# Altium schematic sheet STMKernel144.SchDoc
size A3
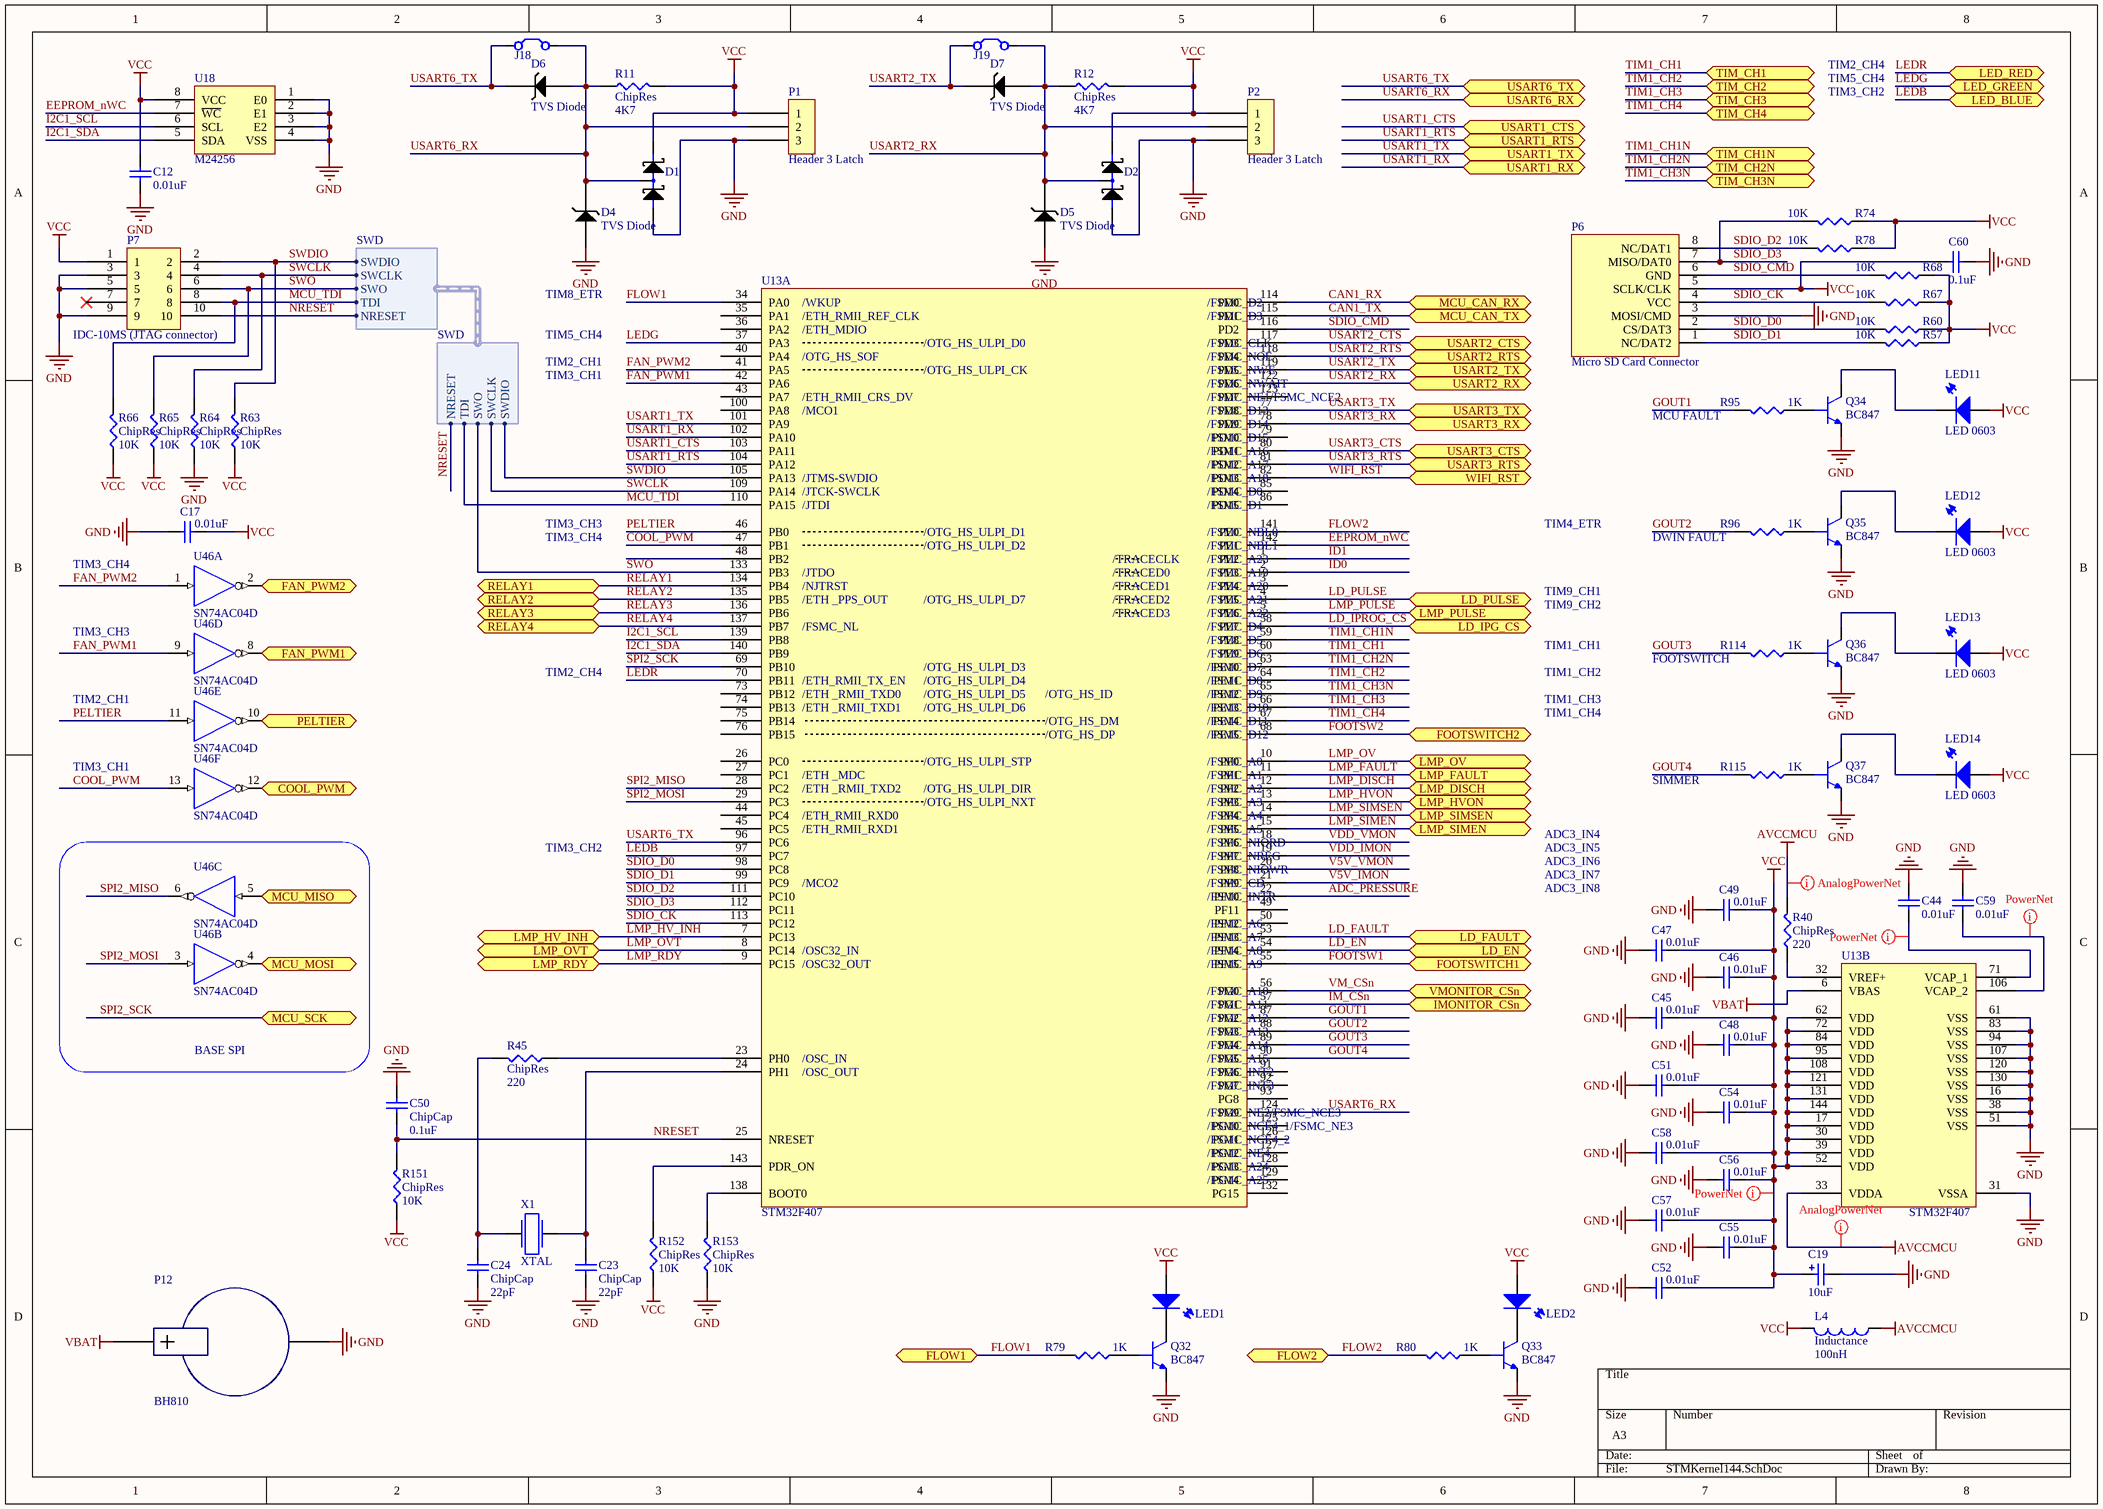
[diagram p0: STMKernel144.SchDoc]

## Parts
C12  value 0.01uF  [CAP0805]  (hidden comment: ChipCap)
C17  value 0.01uF  [CAP0805]  (hidden comment: ChipCap)
C19  value 10uF  [CAPC7343]  (hidden comment: Cap Pol SMD)
C23  ChipCap  value 22pF  [CAP0805]
C24  ChipCap  value 22pF  [CAP0805]
C44  value 0.01uF  [CAP0805]  (hidden comment: ChipCap)
C45  value 0.01uF  [CAP0805]  (hidden comment: ChipCap)
C46  value 0.01uF  [CAP0805]  (hidden comment: ChipCap)
C47  value 0.01uF  [CAP0805]  (hidden comment: ChipCap)
C48  value 0.01uF  [CAP0805]  (hidden comment: ChipCap)
C49  value 0.01uF  [CAP0805]  (hidden comment: ChipCap)
C50  ChipCap  value 0.1uF  [CAP0805]
C51  value 0.01uF  [CAP0805]  (hidden comment: ChipCap)
C52  value 0.01uF  [CAP0805]  (hidden comment: ChipCap)
C54  value 0.01uF  [CAP0805]  (hidden comment: ChipCap)
C55  value 0.01uF  [CAP0805]  (hidden comment: ChipCap)
C56  value 0.01uF  [CAP0805]  (hidden comment: ChipCap)
C57  value 0.01uF  [CAP0805]  (hidden comment: ChipCap)
C58  value 0.01uF  [CAP0805]  (hidden comment: ChipCap)
C59  value 0.01uF  [CAP0805]  (hidden comment: ChipCap)
C60  value 0.1uF  [CAP0805]  (hidden comment: ChipCap)
D1  Diode Schottky  [SOT23]  (value not drawn)
D2  Diode Schottky  [SOT23]  (value not drawn)
D4  TVS Diode  [DO-214AS]
D5  TVS Diode  [DO-214AS]
D6  TVS Diode  [DO-214AS]
D7  TVS Diode  [DO-214AS]
J18  Jumper  [J0805]  (value not drawn)  (net tie, no BOM)
J19  Jumper  [J0805]  (value not drawn)  (net tie, no BOM)
L4  Inductance  value 100nH  [CM45]
LED1  LED 0603  [LED 0603]  (value not drawn)
LED2  LED 0603  [LED 0603]  (value not drawn)
LED11  LED 0603  [PLCC-2]
LED12  LED 0603  [PLCC-2]
LED13  LED 0603  [PLCC-2]
LED14  LED 0603  [PLCC-2]
P1  Header 3 Latch  [Header 3 latch]
P2  Header 3 Latch  [Header 3 latch]
P6  Micro SD Card Connector  [WR-CRD SD Micro]
P7  IDC-10MS (JTAG connector)  [IDC-10MS(MR)]
P12  BH810  [BH810]
Q32  BC847  [SOT23]
Q33  BC847  [SOT23]
Q34  BC847  [SOT23]
Q35  BC847  [SOT23]
Q36  BC847  [SOT23]
Q37  BC847  [SOT23]
R11  ChipRes  value 4K7  [RES0805]
R12  ChipRes  value 4K7  [RES0805]
R40  ChipRes  value 220  [RES0805]
R45  ChipRes  value 220  [RES0805]
R57  value 10K  [RES0805]  (hidden comment: ChipRes)
R60  value 10K  [RES0805]  (hidden comment: ChipRes)
R63  ChipRes  value 10K  [RES0805]
R64  ChipRes  value 10K  [RES0805]
R65  ChipRes  value 10K  [RES0805]
R66  ChipRes  value 10K  [RES0805]
R67  value 10K  [RES0805]  (hidden comment: ChipRes)
R68  value 10K  [RES0805]  (hidden comment: ChipRes)
R74  value 10K  [RES0805]  (hidden comment: ChipRes)
R78  value 10K  [RES0805]  (hidden comment: ChipRes)
R79  value 1K  [RES0805]  (hidden comment: ChipRes)
R80  value 1K  [RES0805]  (hidden comment: ChipRes)
R95  value 1K  [RES0805]  (hidden comment: ChipRes)
R96  value 1K  [RES0805]  (hidden comment: ChipRes)
R114  value 1K  [RES0805]  (hidden comment: ChipRes)
R115  value 1K  [RES0805]  (hidden comment: ChipRes)
R151  ChipRes  value 10K  [RES0805]
R152  ChipRes  value 10K  [RES0805]
R153  ChipRes  value 10K  [RES0805]
U13  STM32F407  [LQFP144]  (parts A,B of 2)
U18  M24256  [SOIC8]
U46  SN74AC04D  [D014_N]  (parts A,B,C,D,E,F of 6)
X1  XTAL  [BCY-W2/E4.7]

## Blocks framed on the sheet
BASE SPI: U46

## Ports
COOL_PWM, FAN_PWM1, FAN_PWM2, FLOW1, FLOW2, FOOTSWITCH1, FOOTSWITCH2, IMONITOR_CSn, LD_EN, LD_FAULT, LD_IPG_CS, LD_PULSE, LED_BLUE, LED_GREEN, LED_RED, LMP_DISCH, LMP_FAULT, LMP_HV_INH, LMP_HVON, LMP_OV, LMP_OVT, LMP_PULSE, LMP_RDY, LMP_SIMEN, LMP_SIMSEN, MCU_CAN_RX, MCU_CAN_TX, MCU_MISO, MCU_MOSI, MCU_SCK, PELTIER, RELAY1, RELAY2, RELAY3, RELAY4, TIM_CH1, TIM_CH1N, TIM_CH2, TIM_CH2N, TIM_CH3, TIM_CH3N, TIM_CH4, USART1_CTS, USART1_RTS, USART1_RX, USART1_TX, USART2_CTS, USART2_RTS, USART2_RX, USART2_TX, USART3_CTS, USART3_RTS, USART3_RX, USART3_TX, USART6_RX, USART6_TX, VMONITOR_CSn, WIFI_RST

## Harnesses
SWD: SWDIO, SWCLK, SWO, TDI, NRESET

## Nets
AVCCMCU: L4.2 R40.2 U13.33(VDDA)
GND: C12.1 C17.1 C19.2 C23.1 C24.1 C44.1 C45.2 C46.2 C47.2 C48.2 C49.2 C50.2 C51.2 C52.1 C54.2 C55.2 C56.2 C57.2 C58.2 C59.1 C60.2 D1.1 D2.1 D4.2 D5.2 P1.3 P2.3 P6.3(MOSI/CMD) P7.3 P7.5 P7.9 P12.1(BN) Q32.2 Q33.2 Q34.2 Q35.2 Q36.2 Q37.2 R64.1 R153.1 U13.16(VSS) U13.31(VSSA) U13.38(VSS) U13.51(VSS) U13.61(VSS) U13.83(VSS) U13.94(VSS) U13.107(VSS) U13.120(VSS) U13.130(VSS) U18.1(E0) U18.2(E1) U18.3(E2) U18.4(VSS) U46.7(GND)
VBAT: P12.2(BP) U13.6(VBAS)
VCC: C12.2 C17.2 C19.1 C45.1 C46.1 C47.1 C48.1 C49.1 C51.1 C52.2 C54.1 C55.1 C56.1 C57.1 C58.1 C60.1 D1.2 D2.2 L4.1 LED1.2 LED2.2 LED11.2 LED12.2 LED13.2 LED14.2 P1.1 P2.1 P6.5(SCLK/CLK) P7.1 R11.2 R12.2 R57.2 R60.2 R63.1 R65.1 R66.1 R67.2 R68.2 R74.2 R78.2 R151.1 R152.1 U13.17(VDD) U13.30(VDD) U13.39(VDD) U13.52(VDD) U13.62(VDD) U13.72(VDD) U13.84(VDD) U13.95(VDD) U13.108(VDD) U13.121(VDD) U13.131(VDD) U13.144(VDD) U18.8(VCC) U46.14(VCC)
ADC_PRESSURE: U13.22(PF10)
CAN1_RX: U13.114(PD0) ; port MCU_CAN_RX
CAN1_TX: U13.115(PD1) ; port MCU_CAN_TX
COOL_PWM: U13.47(PB1) U46.13(A)
COOL_PWM: U46.12(Y) ; port COOL_PWM  [a separate net that carries the same name]
EEPROM_nWC: U13.142(PE1) U18.7(~{WC})
FAN_PWM1: U13.42(PA6) U46.9(A)
FAN_PWM1: U46.8(Y) ; port FAN_PWM1  [a separate net that carries the same name]
FAN_PWM2: U13.41(PA5) U46.1(A)
FAN_PWM2: U46.2(Y) ; port FAN_PWM2  [a separate net that carries the same name]
FLOW1: R79.1 U13.34(PA0) ; port FLOW1
FLOW2: R80.1 U13.141(PE0) ; port FLOW2
FOOTSW1: U13.55(PF15) ; port FOOTSWITCH1
FOOTSW2: U13.68(PE15) ; port FOOTSWITCH2
GOUT1: R95.1 U13.87(PG2)
GOUT2: R96.1 U13.88(PG3)
GOUT3: R114.1 U13.89(PG4)
GOUT4: R115.1 U13.90(PG5)
I2C1_SCL: U13.139(PB8) U18.6(SCL)
I2C1_SDA: U13.140(PB9) U18.5(SDA)
ID0: U13.2(PE3)
ID1: U13.1(PE2)
IM_CSn: U13.57(PG1) ; port IMONITOR_CSn
LD_EN: U13.54(PF14) ; port LD_EN
LD_FAULT: U13.53(PF13) ; port LD_FAULT
LD_IPROG_CS: U13.58(PE7) ; port LD_IPG_CS
LD_PULSE: U13.4(PE5) ; port LD_PULSE
LEDB: U13.97(PC7) ; port LED_BLUE
LEDG: U13.37(PA3) ; port LED_GREEN
LEDR: U13.70(PB11) ; port LED_RED
LMP_DISCH: U13.12(PF2) ; port LMP_DISCH
LMP_FAULT: U13.11(PF1) ; port LMP_FAULT
LMP_HV_INH: U13.7(PC13) ; port LMP_HV_INH
LMP_HVON: U13.13(PF3) ; port LMP_HVON
LMP_OV: U13.10(PF0) ; port LMP_OV
LMP_OVT: U13.8(PC14) ; port LMP_OVT
LMP_PULSE: U13.5(PE6) ; port LMP_PULSE
LMP_RDY: U13.9(PC15) ; port LMP_RDY
LMP_SIMEN: U13.15(PF5) ; port LMP_SIMEN
LMP_SIMSEN: U13.14(PF4) ; port LMP_SIMSEN
MCU_MISO: U46.5(A) ; port MCU_MISO
MCU_MOSI: U46.4(Y) ; port MCU_MOSI
MCU_TDI: P7.8 R66.2 U13.110(PA15) ; harness SWD.TDI
NRESET: C50.1 P7.10 R151.2 U13.25(NRESET) ; harness SWD.NRESET
PELTIER: U13.46(PB0) U46.11(A)
PELTIER: U46.10(Y) ; port PELTIER  [a separate net that carries the same name]
RELAY1: U13.134(PB4) ; port RELAY1
RELAY2: U13.135(PB5) ; port RELAY2
RELAY3: U13.136(PB6) ; port RELAY3
RELAY4: U13.137(PB7) ; port RELAY4
SDIO_CK: P6.4(VCC) R67.1 U13.113(PC12)
SDIO_CMD: P6.6(GND) R68.1 U13.116(PD2)
SDIO_D0: P6.2(CS/DAT3) R60.1 U13.98(PC8)
SDIO_D1: P6.1(NC/DAT2) R57.1 U13.99(PC9)
SDIO_D2: P6.8(NC/DAT1) R78.1 U13.111(PC10)
SDIO_D3: P6.7(MISO/DAT0) R74.1 U13.112(PC11)
SPI2_MISO: U13.28(PC2) U46.6(Y)
SPI2_MOSI: U13.29(PC3) U46.3(A)
SPI2_SCK: U13.69(PB10) ; port MCU_SCK
SWCLK: P7.4 R64.2 U13.109(PA14) ; harness SWD.SWCLK
SWDIO: P7.2 R63.2 U13.105(PA13) ; harness SWD.SWDIO
SWO: P7.6 R65.2 U13.133(PB3) ; harness SWD.SWO
TIM1_CH1: U13.60(PE9) ; port TIM_CH1
TIM1_CH1N: U13.59(PE8) ; port TIM_CH1N
TIM1_CH2: U13.64(PE11) ; port TIM_CH2
TIM1_CH2N: U13.63(PE10) ; port TIM_CH2N
TIM1_CH3: U13.66(PE13) ; port TIM_CH3
TIM1_CH3N: U13.65(PE12) ; port TIM_CH3N
TIM1_CH4: U13.67(PE14) ; port TIM_CH4
USART1_CTS: U13.103(PA11) ; port USART1_CTS
USART1_RTS: U13.104(PA12) ; port USART1_RTS
USART1_RX: U13.102(PA10) ; port USART1_RX
USART1_TX: U13.101(PA9) ; port USART1_TX
USART2_CTS: U13.117(PD3) ; port USART2_CTS
USART2_RTS: U13.118(PD4) ; port USART2_RTS
USART2_RX: D2.3 D5.1 D7.2 J19.1 P2.2 R12.1 U13.122(PD6) ; port USART2_RX
USART2_TX: D7.1 J19.0 U13.119(PD5) ; port USART2_TX
USART3_CTS: U13.80(PD11) ; port USART3_CTS
USART3_RTS: U13.81(PD12) ; port USART3_RTS
USART3_RX: U13.78(PD9) ; port USART3_RX
USART3_TX: U13.77(PD8) ; port USART3_TX
USART6_RX: D1.3 D4.1 D6.2 J18.1 P1.2 R11.1 U13.124(PG9) ; port USART6_RX
USART6_TX: D6.1 J18.0 U13.96(PC6) ; port USART6_TX
V5V_IMON: U13.21(PF9)
V5V_VMON: U13.20(PF8)
VDD_IMON: U13.19(PF7)
VDD_VMON: U13.18(PF6)
VM_CSn: U13.56(PG0) ; port VMONITOR_CSn
WIFI_RST: U13.82(PD13) ; port WIFI_RST
NetC23_2: C23.2 U13.24(PH1) X1.2
NetC24_2: C24.2 R45.2 X1.1
NetC44_2: C44.2 U13.71(VCAP_1)
NetC59_2: C59.2 U13.106(VCAP_2)
NetLED1_1: LED1.1 Q32.3
NetLED2_1: LED2.1 Q33.3
NetLED11_1: LED11.1 Q34.3
NetLED12_1: LED12.1 Q35.3
NetLED13_1: LED13.1 Q36.3
NetLED14_1: LED14.1 Q37.3
NetQ32_1: Q32.1 R79.2
NetQ33_1: Q33.1 R80.2
NetQ34_1: Q34.1 R95.2
NetQ35_1: Q35.1 R96.2
NetQ36_1: Q36.1 R114.2
NetQ37_1: Q37.1 R115.2
NetR40_1: R40.1 U13.32(VREF+)
NetR45_1: R45.1 U13.23(PH0)
NetR152_2: R152.2 U13.143(PDR_ON)
NetR153_2: R153.2 U13.138(BOOT0)

Not connected (* = marked no-connect by the designer): P7 7*; U13 3(PE4) 26(PC0) 27(PC1) 35(PA1) 36(PA2) 40(PA4) 43(PA7) 44(PC4) 45(PC5) 48(PB2) 49(PF11) 50(PF12) 73(PB12) 74(PB13) 75(PB14) 76(PB15) 79(PD10) 85(PD14) 86(PD15) 91(PG6) 92(PG7) 93(PG8) 100(PA8) 123(PD7) 125(PG10) 126(PG11) 127(PG12) 128(PG13) 129(PG14) 132(PG15)

## Layout directives
net class PowerNet: NetC44_2, NetC59_2, VCC
net class AnalogPowerNet: AVCCMCU

## Notes on the sheet
- TIM2_CH4
- TIM5_CH4
- TIM3_CH2
- TIM8_ETR
- TIM2_CH1
- TIM3_CH1
- MCU FAULT
- TIM3_CH4
- TIM3_CH3
- TIM4_ETR
- (near R96) DWIN FAULT
- TIM9_CH1
- TIM9_CH2
- TIM1_CH1
- TIM1_CH2
- TIM1_CH3
- TIM1_CH4
- (near R114) FOOTSWITCH
- SIMMER
- ADC3_IN4
- ADC3_IN5
- ADC3_IN6
- ADC3_IN7
- ADC3_IN8
- (in symbol STM32F407ZGT6, part A) /WKUP; /FSMC_D2; /ETH_RMII_REF_CLK; /FSMC_D3; /ETH_MDIO; /OTG_HS_ULPI_D0; /FSMC_CLK; /OTG_HS_SOF; /FSMC_NOE; /OTG_HS_ULPI_CK; /FSMC_NWE; /FSMC_NWAIT; /ETH_RMII_CRS_DV; /FSMC_NE1/FSMC_NCE2; /MCO1; /FSMC_D13; /FSMC_D14; /FSMC_D15; /FSMC_A16; /FSMC_A17; /JTMS-SWDIO; /FSMC_A18; /JTCK-SWCLK; /FSMC_D0; /JTDI; /FSMC_D1; /OTG_HS_ULPI_D1; /FSMC_NBL0; /OTG_HS_ULPI_D2; /FSMC_NBL1; /TRACECLK; /FSMC_A23; /JTDO; /TRACED0; /FSMC_A19; /NJTRST; /TRACED1; /FSMC_A20; /ETH _PPS_OUT; /OTG_HS_ULPI_D7; /TRACED2; /FSMC_A21; /TRACED3; /FSMC_A22; /FSMC_NL; /FSMC_D4; /FSMC_D5; /FSMC_D6; /OTG_HS_ULPI_D3; /FSMC_D7; /ETH_RMII_TX_EN; /OTG_HS_ULPI_D4; /FSMC_D8; /ETH _RMII_TXD0; /OTG_HS_ULPI_D5; /OTG_HS_ID; /FSMC_D9; /ETH _RMII_TXD1; /OTG_HS_ULPI_D6; /FSMC_D10; /OTG_HS_DM; /FSMC_D11; /OTG_HS_DP; /FSMC_D12; /OTG_HS_ULPI_STP; /FSMC_A0; /ETH _MDC; /FSMC_A1; /ETH _RMII_TXD2; /OTG_HS_ULPI_DIR; /FSMC_A2; /OTG_HS_ULPI_NXT; /FSMC_A3; /ETH_RMII_RXD0; /FSMC_A4; /ETH_RMII_RXD1; /FSMC_A5; /FSMC_NIORD; /FSMC_NREG; /FSMC_NIOWR; /MCO2; /FSMC_CD; /FSMC_INTR; /FSMC_A6; /FSMC_A7; /OSC32_IN; /FSMC_A8; /OSC32_OUT; /FSMC_A9; /FSMC_A10; /FSMC_A11; /FSMC_A12; /FSMC_A13; /FSMC_A14; /OSC_IN; /FSMC_A15; /OSC_OUT; /FSMC_INT2; /FSMC_INT3; /FSMC_NE2/FSMC_NCE3; /FSMC_NCE4_1/FSMC_NE3; /FSMC_NCE4_2; /FSMC_NE4; /FSMC_A24; /FSMC_A25

## Library data of the parts
C12 C17 C23 C24 C44-C52 C54-C60 = ChipCap: Capacitor; Published: 8-Jun-2000; LatestRevisionDate: 17-Jul-2002; LatestRevisionNote: Re-released for DXP Platform.; PackageReference: RAD-0.3; Publisher: Altium Limited
C19 = Cap Pol Chip: Polarized Capacitor (Radial); Supplier 1: Digi-Key; Supplier Part Number 1: 399-4029-1-ND
D1 D2 = Schottky Diode: 2-Diode Schottky
D4-D7 = TVS Diode SMA
L4 = ChipInductance
LED1 LED2 LED11-LED14 = LED0603
P1 P2 = Header 3 latch: Header 3 with latch
P6 = MicroSDHeader8
Q32-Q37 = BC847: NPN transistor
R11 R12 R40 R45 R57 R60 R63-R68 R74 R78-R80 R95 R96 R114 R115 R151-R153 = ChipRes: Chip resistor
U13 = STM32F407ZGT6: ST Microcontroller ARM 32-bit Cortex M4
U18 = M24256: 256 Kbit I2C EEPROM
U46 = SN74AC04D: Hex Inverter; Published: 8-Jun-2000; LatestRevisionDate: 13-Apr-2006; LatestRevisionNote: IPC-7351 Footprint Added.; DatasheetVersion: Sep-1996; PackageVersion: Jan-1998; PackageReference: D014; Publisher: Altium Limited; PackageDescription: 14-Pin Small Outline Integrated Circuit 1.27 mm Pitch; Code_IPC: SOIC127P600-14; ComponentLink1Description: Manufacturer Link; ComponentLink1URL: http://www.ti.com/; ComponentLink2Description: Datasheet; ComponentLink2URL: http://www-s.ti.com/sc/ds/sn74ac04.pdf; ComponentLink3Description: Packaging Specification; ComponentLink3URL: http://focus.ti.com/lit/ml/mpds177/mpds177.pdf
X1 = Crystall oscillator: Quartz crystall oscillator